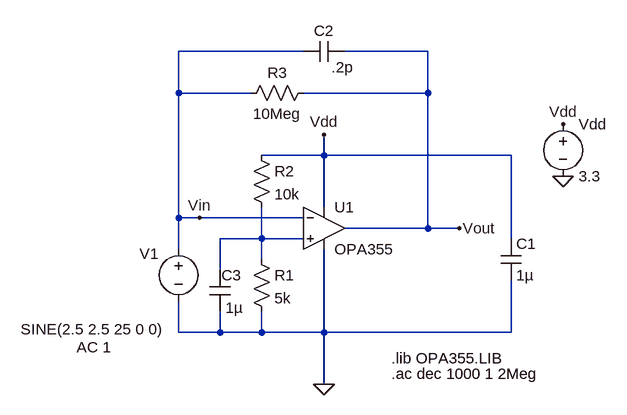
[diagram p0: schematic Task1.asc]
Task1.asc, the LTspice schematic file:
Version 4
SHEET 1 936 680
WIRE 464 32 272 32
WIRE 656 32 528 32
WIRE 272 96 272 32
WIRE 384 96 272 96
WIRE 656 96 656 32
WIRE 656 96 464 96
WIRE 496 192 496 160
WIRE 496 192 400 192
WIRE 784 192 496 192
WIRE 496 272 496 192
WIRE 272 288 272 96
WIRE 304 288 272 288
WIRE 464 288 304 288
WIRE 656 304 656 96
WIRE 656 304 528 304
WIRE 704 304 656 304
WIRE 400 320 400 272
WIRE 400 320 336 320
WIRE 464 320 400 320
WIRE 784 320 784 192
WIRE 272 336 272 288
WIRE 400 352 400 320
WIRE 336 368 336 320
WIRE 272 464 272 416
WIRE 336 464 336 432
WIRE 336 464 272 464
WIRE 400 464 400 432
WIRE 400 464 336 464
WIRE 496 464 496 336
WIRE 496 464 400 464
WIRE 784 464 784 384
WIRE 784 464 496 464
WIRE 496 544 496 464
FLAG 496 160 Vdd
FLAG 496 544 0
FLAG 864 224 0
FLAG 704 304 Vout
FLAG 304 288 Vin
FLAG 864 144 Vdd
SYMBOL OpAmps/opamp2 496 240 R0
SYMATTR InstName U1
SYMATTR Value OPA355
SYMATTR SpiceModel OPA355
SYMBOL cap 768 320 R0
SYMATTR InstName C1
SYMATTR Value 1µ
SYMBOL cap 528 16 R90
WINDOW 0 0 32 VBottom 2
WINDOW 3 25 4 VTop 2
SYMATTR InstName C2
SYMATTR Value .2p
SYMBOL cap 352 432 R180
WINDOW 0 -17 56 Left 2
WINDOW 3 -19 6 Left 2
SYMATTR InstName C3
SYMATTR Value 1µ
SYMBOL res 384 336 R0
SYMATTR InstName R1
SYMATTR Value 5k
SYMBOL res 384 176 R0
SYMATTR InstName R2
SYMATTR Value 10k
SYMBOL res 480 80 R90
WINDOW 0 0 56 VBottom 2
WINDOW 3 32 56 VTop 2
SYMATTR InstName R3
SYMATTR Value 10Meg
SYMBOL voltage 272 320 R0
WINDOW 0 -60 23 Left 2
WINDOW 3 -243 139 Left 2
WINDOW 123 -157 167 Left 2
SYMATTR InstName V1
SYMATTR Value SINE(2.5 2.5 25 0 0)
SYMATTR Value2 AC 1
SYMBOL voltage 864 128 R0
SYMATTR InstName Vdd
SYMATTR Value 3.3
TEXT 600 504 Left 2 !.lib OPA355.LIB
TEXT 600 528 Left 2 !.ac dec 1000 1 2Meg

The netlist it stands for:
* Task1.asc
XU1 N001 Vin Vdd 0 Vout OPA355 OPA355  ; pins In+ In- V+ V- OUT
C1 Vdd 0 1µ
C2 Vout Vin .2p
C3 0 N001 1µ
R1 N001 0 5k
R2 Vdd N001 10k
R3 Vout Vin 10Meg
V1 Vin 0 SINE(2.5 2.5 25 0 0) AC 1
Vdd Vdd 0 3.3
.lib OPA355.LIB
.ac dec 1000 1 2Meg
.backanno
.end